# Altium schematic sheet ArbPwrBoost_P6.SchDoc: =ProjectTitle
size B; Engineer: Hab Collector; Organization: Altium Limited; Address1: 3621 Gin Way; Address2: Snellville, GA 30039; SheetNumber: 6; SheetTotal: 8
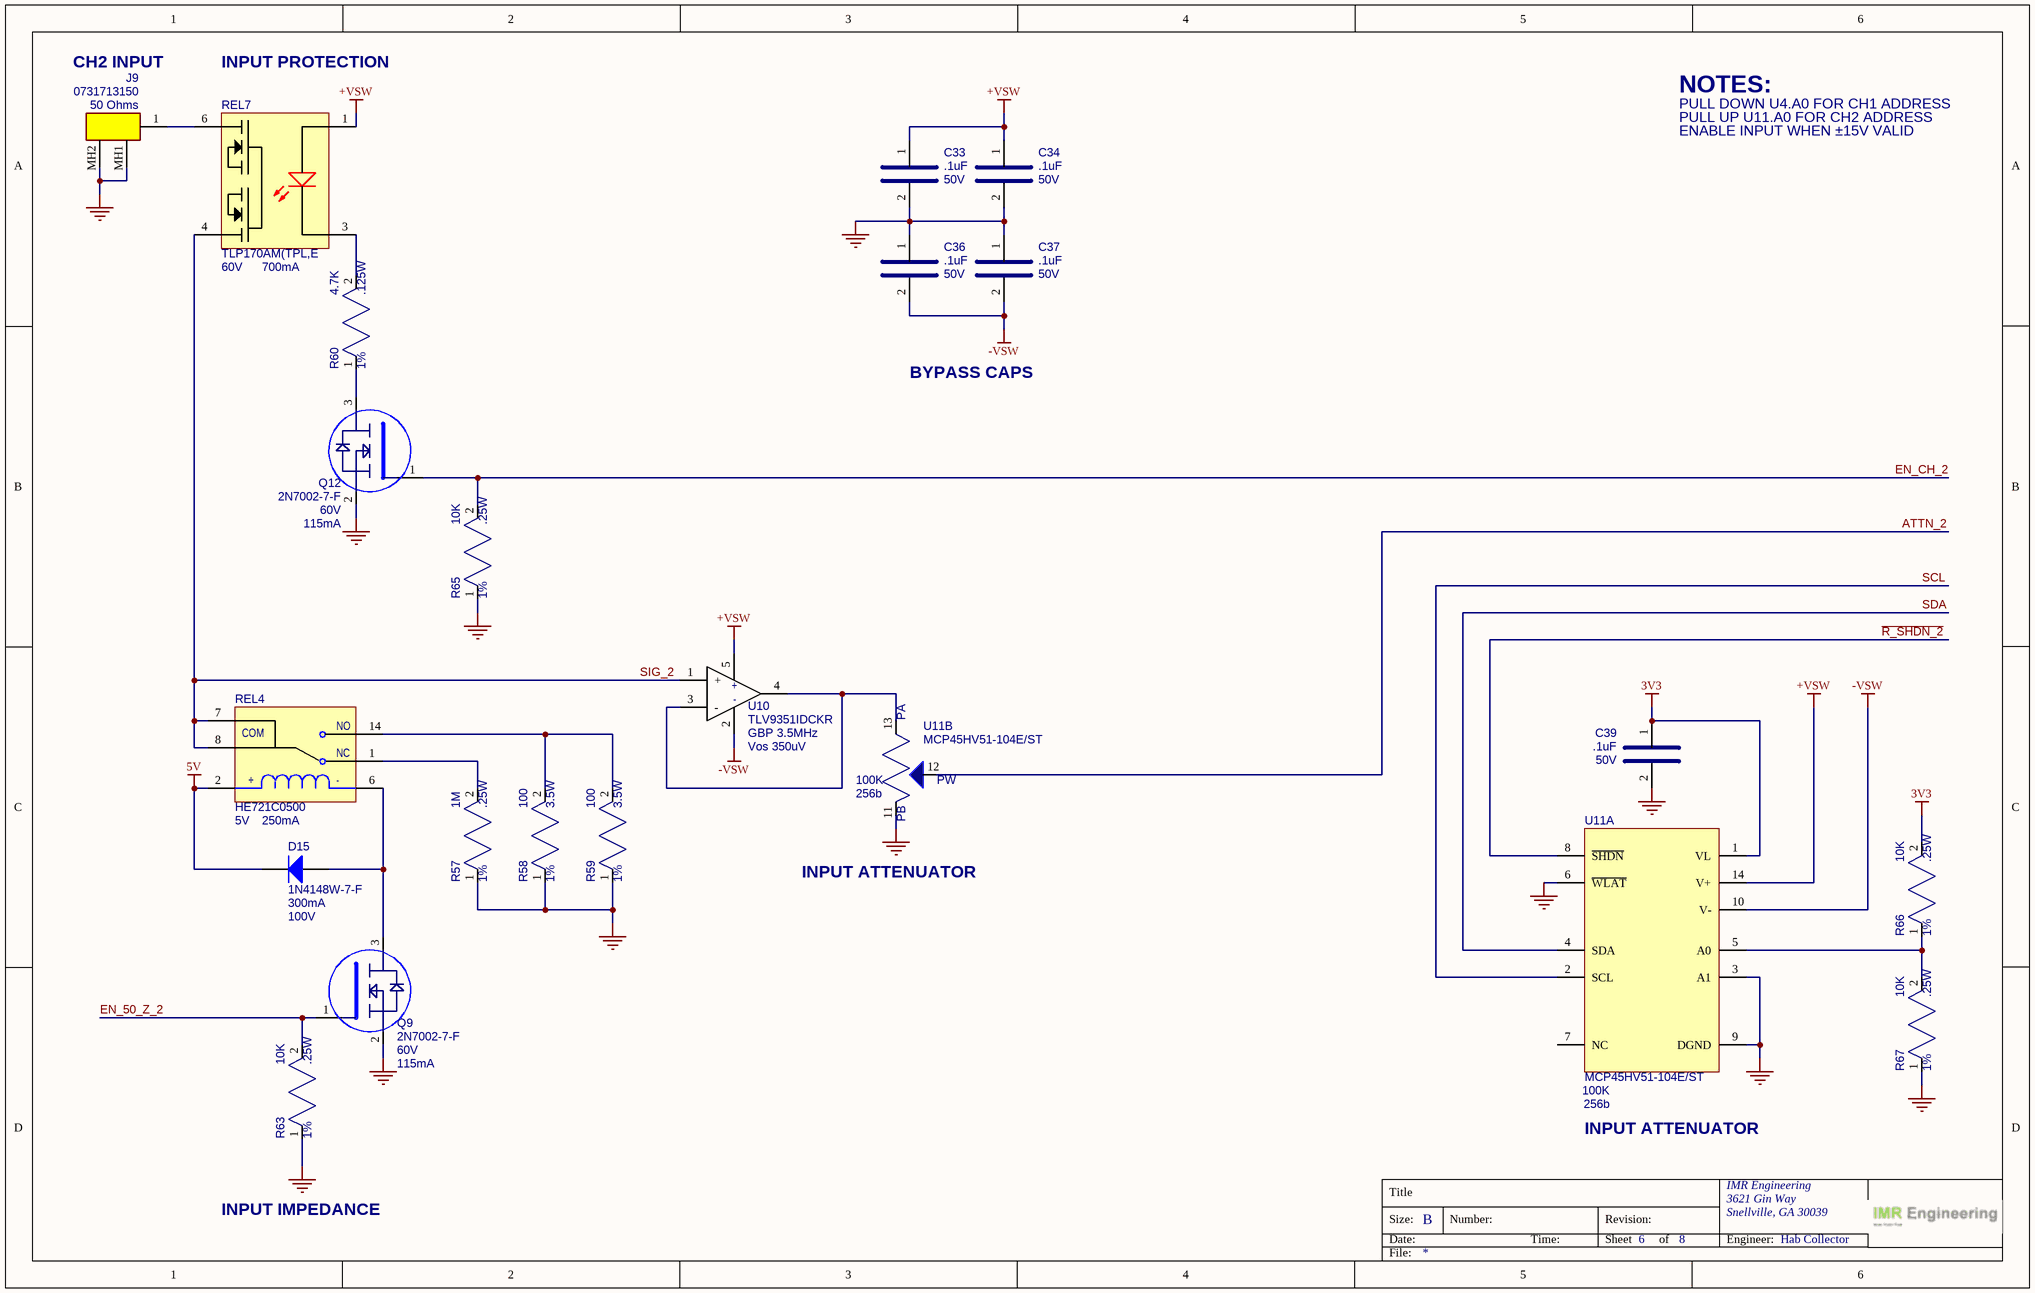
[diagram p0: ArbPwrBoost_P6.SchDoc]

## Parts
C33  value .1uF  Voltage: 50V  [CAP_0805]  (hidden comment: KGM21NR71H104KT)
C34  value .1uF  Voltage: 50V  [CAP_0805]  (hidden comment: KGM21NR71H104KT)
C36  value .1uF  Voltage: 50V  [CAP_0805]  (hidden comment: KGM21NR71H104KT)
C37  value .1uF  Voltage: 50V  [CAP_0805]  (hidden comment: KGM21NR71H104KT)
C39  value .1uF  Voltage: 50V  [CAP_0805]  (hidden comment: KGM21NR71H104KT)
D15  value 100V  Current: 300mA  [SOD123]  (hidden comment: 1N4148W-7-F)
J9  value 50 Ohms  [731713150]  (hidden comment: 0731713150)
Q9  value 60V  Current: 115mA  [SOT-23]  (hidden comment: 2N7002-7-F)
Q12  value 60V  Current: 115mA  [SOT-23]  (hidden comment: 2N7002-7-F)
R57  value 1M  Power: .25W  Tolerance: 1%  [RES_0805]  (hidden comment: RC0805FR-7W1ML)
R58  value 100  Power: 3.5W  Tolerance: 1%  [RES_2512]  (hidden comment: ALN2512F100RE-1)
R59  value 100  Power: 3.5W  Tolerance: 1%  [RES_2512]  (hidden comment: ALN2512F100RE-1)
R60  value 4.7K  Power: .125W  Tolerance: 1%  [RES_0805]  (hidden comment: RC0805FR-134K7L)
R63  value 10K  Power: .25W  Tolerance: 1%  [RES_0805]  (hidden comment: RC0805FR-7W10KL)
R65  value 10K  Power: .25W  Tolerance: 1%  [RES_0805]  (hidden comment: RC0805FR-7W10KL)
R66  value 10K  Power: .25W  Tolerance: 1%  [RES_0805]  (hidden comment: RC0805FR-7W10KL)
R67  value 10K  Power: .25W  Tolerance: 1%  [RES_0805]  (hidden comment: RC0805FR-7W10KL)
REL4  value 5V  Current: 250mA  [HE700]  (hidden comment: HE721C0500)
REL7  value 60V  Current: 700mA  [SOP-6]  (hidden comment: TLP170AM(TPL,E)
U10  value GBP 3.5MHz  Vos: Vos 350uV  [SOT-353]  (hidden comment: TLV9351IDCKR)
U11  value 100K  TAP: 256b  [TSSOP-14]  (hidden comment: MCP45HV51-104E/ST)  (parts A,B of 2)

## Nets
3V3: C39.1 R66.2 U11.1(VL)
5V: D15.2(K) REL4.2
+VSW: C33.1 C34.1 REL7.1 U10.5 U11.14(V+)
-VSW: C36.2 C37.2 U10.2 U11.10(V-)
GND: C33.2 C34.2 C36.1 C37.1 C39.2 J9.MH1 J9.MH2 Q9.2(E) Q12.2(E) R57.1 R58.1 R59.1 R63.1 R65.1 R67.1 U11.3(A1) U11.6(~{WLAT}) U11.9(DGND) U11.11(PB0)
~{R_SHDN_2}: U11.8(~{SHDN})
ATTN_2: U11.12(PW0)
EN_50_Z_2: Q9.1(B) R63.2
EN_CH_2: Q12.1(B) R65.2
SCL: U11.2(SCL)
SDA: U11.4(SDA)
SIG_2: REL4.7(COM) REL4.8(COM) REL7.4 U10.1(+)
NetD15_1: D15.1(A) Q9.3(C) REL4.6
NetJ9_1: J9.1 REL7.6
NetQ12_3: Q12.3(C) R60.1
NetR57_2: R57.2 REL4.1(NC)
NetR58_2: R58.2 R59.2 REL4.14(NO)
NetR60_2: R60.2 REL7.3
NetR66_1: R66.1 R67.2 U11.5(A0)
NetU10_3: U10.3(-) U10.4 U11.13(PA)

Not connected (* = marked no-connect by the designer): U11 7(NC)

## Notes on the sheet
- CH2 INPUT
- INPUT PROTECTION
- NOTES:
- PULL DOWN U4.A0 FOR CH1 ADDRESS
- PULL UP U11.A0 FOR CH2 ADDRESS
- ENABLE INPUT WHEN ±15V VALID
- BYPASS CAPS
- INPUT ATTENUATOR
- INPUT IMPEDANCE
- Title
- Size:
- Date:
- B
- Number:
- Time:
- Revision:
- Sheet
- of
- IMR Engineering
- Engineer:
- File:
- (in symbol IC_MCP45HV51-104E/ST, part B) PW; PB
- (in symbol RELAY_HE721C0500) +; -

## Library data of the parts
C33 C34 C36 C37 C39 = CAP_SMD_0.1UF_50V_0805: CAP CER 0.1UF 50V X7R 0805; MFG: KYOCERA AVX; Case/Package: 0805; MFG_PN: KGM21NR71H104KT; Supplier 1: DigiKey; Supplier Part Number 1: 478-KGM21NR71H104KTCT-ND; Unit Price: .1
D15 = DIODE_1N4148W-7-F: RELAY REED SPDT 250MA 5V; MFG: Diodes Inc; Case/Package: SOD-123; Supplier 1: DigiKey; Supplier Part Number 1: 1N4148W-FDICT-ND; Unit Price: .16; MFG_PN: 1N4148W-7-F
J9 = CONN_MOLEX_0731713150: CONN BNC RCPT R/A 50 OHM PCB; MFG: Molex; Case/Package: 73099-2; Supplier 1: DigiKey; Supplier Part Number 1: WM20430-ND; Unit Price: 1.40; MFG_PN: 0731713150
Q9 Q12 = MOSFET_NCH_2N7002-7-F: MOSFET N-CH 60V 115MA SOT23-3; MFG: Diodes Inc; Case/Package: SOT-23; Supplier 1: DigiKey; Supplier Part Number 1: 2N7002-FDICT-ND; Unit Price: .20; MFG_PN: 2N7002-7-F
R57 = RES_SMD_1M_0805_1/4W_1%: RES SMD 1K OHM 1% 1/4W 0805; MFG: Yageo; Case/Package: 0805; MFG_PN: RC0805FR-7W1ML; Supplier 1: DigiKey; Supplier Part Number 1: 13-RC0805FR-7W1MLCT-ND; Unit Price: .10
R58 R59 = RES_SMD_100_0805_3.5W_1%: RES SMD 100 OHM 1% 3.5W 2512; MFG: Ohmite; Case/Package: 2512; MFG_PN: ALN2512F100RE-1; Supplier 1: DigiKey; Supplier Part Number 1: 273-ALN2512F100RE-1CT-ND; Unit Price: 1.50
R60 = RES_SMD_4.7K_0805_1/8W_1%: RES SMD 4.7K OHM 1% 1/8W 0805; MFG: Yageo; Case/Package: 0805; MFG_PN: RC0805FR-134K7L; Supplier 1: DigiKey; Supplier Part Number 1: 13-RC0805FR-134K7LCT-ND; Unit Price: .1
R63 R65-R67 = RES_SMD_10K_0805_1/4W_1%: RES SMD 10K OHM 1% 1/4W 0805; MFG: Yageo; Case/Package: 0805; MFG_PN: RC0805FR-7W10KL; Supplier 1: DigiKey; Supplier Part Number 1: 13-RC0805FR-7W10KLCT-ND; Unit Price: .10
REL4 = RELAY_HE721C0500: RELAY REED SPDT 250MA 5V; MFG: Littlefuse; Case/Package: HE700; Supplier 1: DigiKey; Supplier Part Number 1: HE112-ND; Unit Price: 3.77; MFG_PN: HE721C0500
REL7 = RELAY_TLP170AM(TPL,E: SSR RELAY SPST-NO 700MA 0-60V; MFG: Toshiba; Case/Package: SOP-6; Supplier 1: DigiKey; Supplier Part Number 1: 264-TLP170AM(TPLECT-ND; Unit Price: 1.33; MFG_PN: TLP170AM(TPL,E
U10 = OPAMP_TLV9351IDCKR: IC OPAMP GP 3.5MHZ 350uV C70-5; MFG: Texas Instruments; Package/Case: SOT-353; Supplier 1: DigiKey; MFG_PN: TLV9351IDCKR; Unit Price: .49; Supplier Part Number 1: 296-TLV9351IDCKRCT-ND
U11 = IC_MCP45HV51-104E/ST: IC DGT POT 100KOHM 256TP 14TSSOP; MFG: Microchip; Case/Package: TSSOP-14; Supplier 1: DigiKey; Supplier Part Number 1: MCP45HV51-104E/ST-ND; Unit Price: 2.00; MFG_PN: MCP45HV51-104E/ST